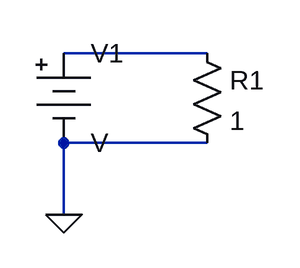
[diagram p0: schematic Yoneda-p26.asc]
Yoneda-p26.asc, the LTspice schematic file:
Version 4
SHEET 1 880 680
WIRE 160 48 32 48
WIRE 160 128 32 128
WIRE 32 192 32 128
FLAG 32 192 0
SYMBOL res 144 32 R0
SYMATTR InstName R1
SYMATTR Value 1
SYMBOL Misc\\battery 32 32 R0
SYMATTR InstName V1

The netlist it stands for:
* Yoneda-p26.asc
R1 N001 0 1
V1 N001 0 V
.backanno
.end